# EAGLE design Programmer (EAGLE 4.09)
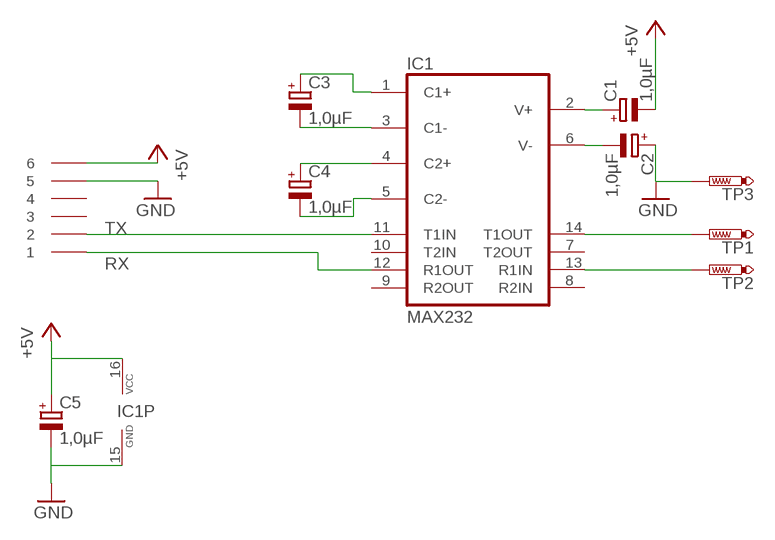
[diagram p0: schematic, sheet 1]

## Parts
C1  1,0µF  CPOL-EUE2-5  [E2-5]
C2  1,0µF  CPOL-EUE2-5  [E2-5]
C3  1,0µF  CPOL-EUE2-5  [E2-5]
C4  1,0µF  CPOL-EUE2-5  [E2-5]
C5  1,0µF  CPOL-EUE2-5  [E2-5]
IC1  MAX232  [DIL16]
KL1  AST021-06  [AST021-06]
TP1  P1-13  [P1-13]
TP2  P1-13  [P1-13]
TP3  P1-13  [P1-13]

## Nets
+5V: C1.- C5.+ IC1.16(VCC) KL1.P$6
GND: C2.+ C5.- IC1.15(GND) KL1.P$5 TP3.1(PS)
N$1: C4.+ IC1.4(C2+)
N$2: C4.- IC1.5(C2-)
N$3: C3.- IC1.3(C1-)
N$4: C3.+ IC1.1(C1+)
N$5: C2.- IC1.6(V-)
N$6: C1.+ IC1.2(V+)
RS232_RX: IC1.13(R1IN) TP2.1(PS)
RS232_TX: IC1.14(T1OUT) TP1.1(PS)
RX_TTL: IC1.12(R1OUT) KL1.P$1
TX_TTL: IC1.11(T1IN) KL1.P$2
Unconnected: IC1.7(T2OUT) IC1.8(R2IN) IC1.9(R2OUT) IC1.10(T2IN) KL1.P$3 KL1.P$4

## Notes on the sheet
- TX
- RX

## Library data of the parts
C1-C5 = rcl:CPOL-EU: POLARIZED CAPACITOR, European symbol
IC1 = maxim:MAX232: RS232 TRANSEIVER
KL1 = con-ria:AST021-06
TP1-TP3 = testpad:P1-13: TEST PIN

## Board
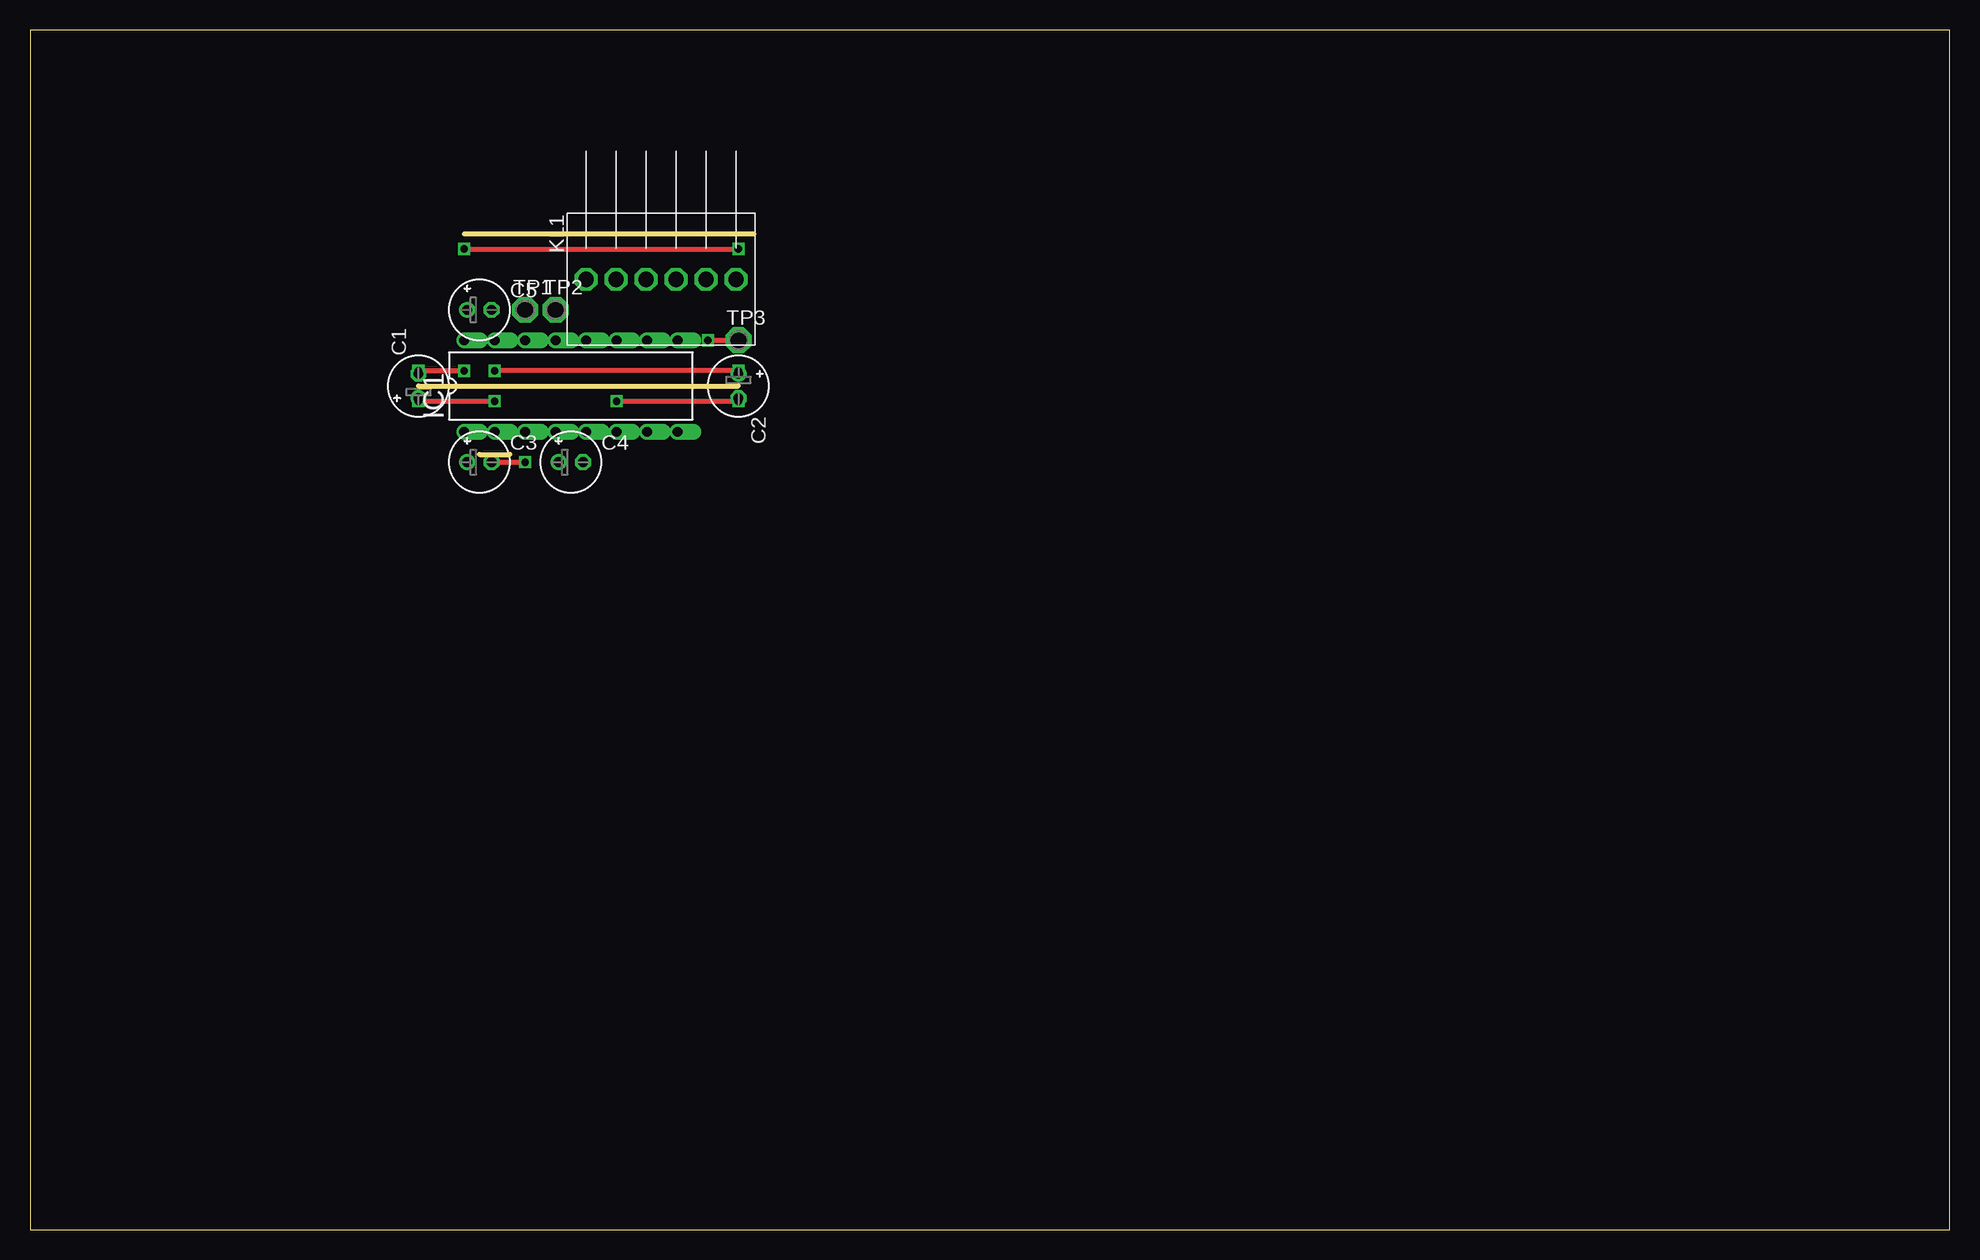
[diagram p1: board, top side]
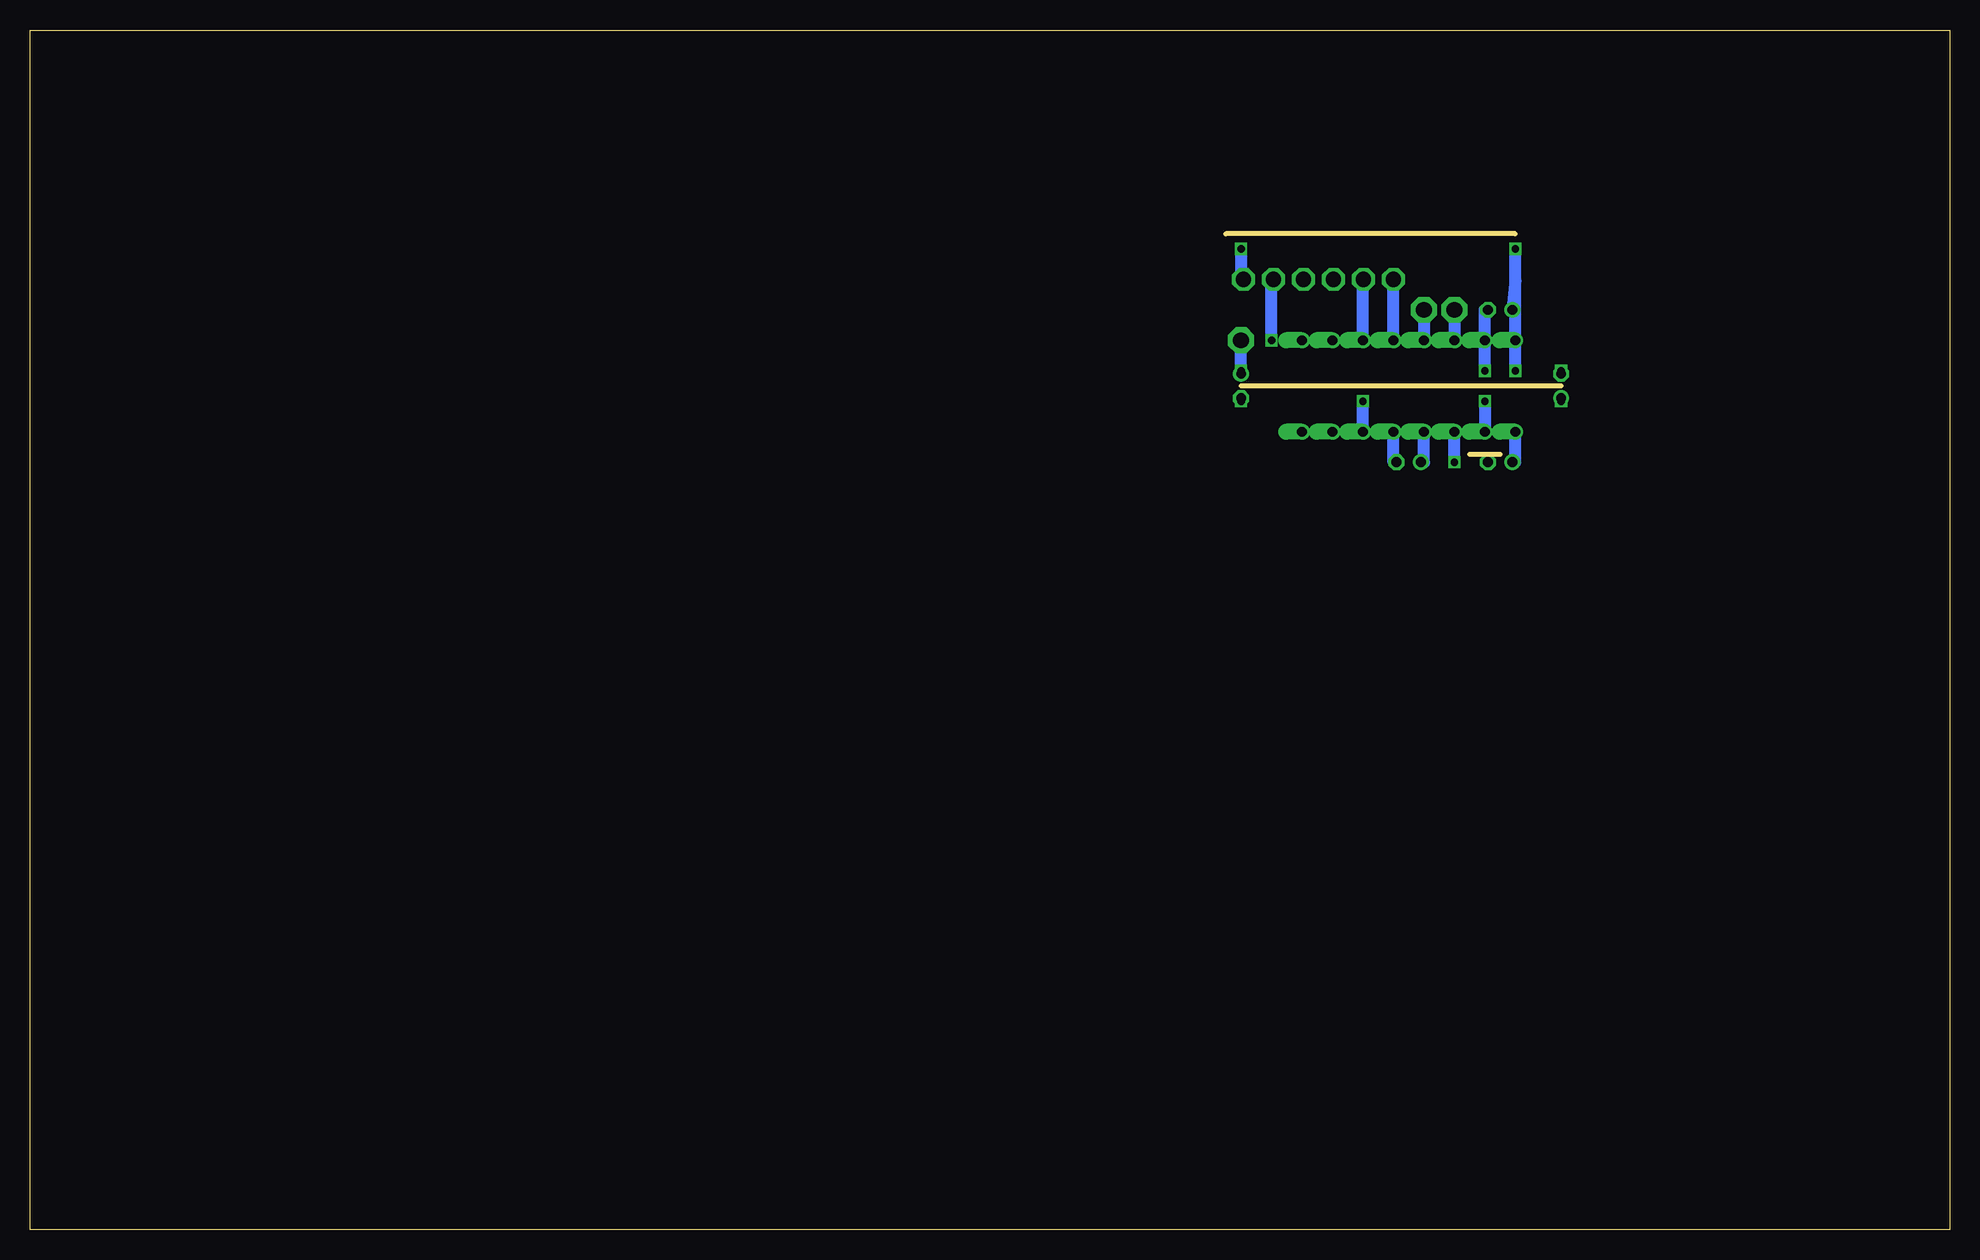
[diagram p2: board, bottom side, seen from below]

Size 160 x 100 mm. Coordinates in mm from the lower left corner, seen from the top.
Outline: 0,0 160,0 160,100 0,100 0,0
Copper layers used: Top, Bottom
Milling: 3 lines

### Footprints (pad centres in the part's own frame; a part is rotated, then mirrored left to right if it is on the bottom)
E2-5 = drill 0.813 pad 1.27 round: + -1.016,0 | drill 0.813 pad 1.27 octagon: - 1.016,0
DIL16 = drill 0.813 offset: 1 -8.89,-3.81; 2 -6.35,-3.81; 3 -3.81,-3.81; 4 -1.27,-3.81; 5 1.27,-3.81; 6 3.81,-3.81; 7 6.35,-3.81; 8 8.89,-3.81; 9 8.89,3.81; 10 6.35,3.81; 11 3.81,3.81; 12 1.27,3.81; 13 -1.27,3.81; 14 -3.81,3.81; 15 -6.35,3.81; 16 -8.89,3.81
AST021-06 = drill 1.27 octagon: P$1 0,0; P$2 0,2.5; P$3 0,5; P$4 0,7.5; P$5 0,10; P$6 0,12.5
P1-13 = drill 1.321 pad 2.159 octagon: 1 0,0

### Placement (x,y rotation side)
C1  32.38,70.32 90 top
C2  59.05,70.32 270 top
C3  37.46,63.97 0 top
C4  45.08,63.97 0 top
C5  37.46,76.67 0 top
IC1  45.08,70.32 0 top
KL1  46.35,79.21 270 top
TP1  41.27,76.67 0 top
TP2  43.81,76.67 0 top
TP3  59.05,74.13 0 top

### Tracks (layer width: path | path; a pad name or v marks a point on that pad's centre or on a via)
+5V  (via drill 0.61)
  Top 0.406: v36.19,81.75 v59.05,81.75 | v32.38,71.59 v36.19,71.59
  Bottom 0.406: 59.05,79.21 KL1.P$6
  Bottom 1.016: v36.19,71.59 IC1.16 36.19,79.21 | C1.- v32.38,71.59 | 36.19,79.21 C5.+ | v59.05,81.75 59.05,79.21 | 36.19,79.21 v36.19,81.75
GND  (via drill 0.61)
  Top 0.406: v59.05,71.59 v38.73,71.59 | v56.51,74.13 TP3.1
  Bottom 0.406: 56.51,79.21 KL1.P$5
  Bottom 1.016: C2.+ v59.05,71.59 TP3.1 | v38.73,71.59 IC1.15 38.73,76.67 C5.- | v56.51,74.13 56.51,79.21
N$1
  Bottom 1.016: C4.+ 43.81,63.97 IC1.4
N$2
  Bottom 1.016: C4.- 46.35,63.97 IC1.5
N$3  (via drill 0.61)
  Top 0.406: C3.- v41.27,63.97
  Bottom 1.016: v41.27,63.97 IC1.3
N$4
  Bottom 1.016: C3.+ 36.19,63.97 IC1.1
N$5  (via drill 0.61)
  Top 0.406: v48.89,69.05 v59.05,69.05
  Bottom 1.016: IC1.6 v48.89,69.05 | v59.05,69.05 C2.-
N$6  (via drill 0.61)
  Top 0.406: v32.38,69.05 v38.73,69.05
  Bottom 1.016: v38.73,69.05 IC1.2 | C1.+ v32.38,69.05
RS232_RX
  Bottom 1.016: TP2.1 IC1.13
RS232_TX
  Bottom 1.016: TP1.1 IC1.14
RX_TTL
  Bottom 1.016: IC1.12 KL1.P$1
TX_TTL
  Bottom 0.406: 48.89,79.21 KL1.P$2
  Bottom 1.016: IC1.11 48.89,79.21